# Altium schematic sheet dtb-222.SchDoc
size 381 x 241 mm; SheetNumber: 1; SheetTotal: 1
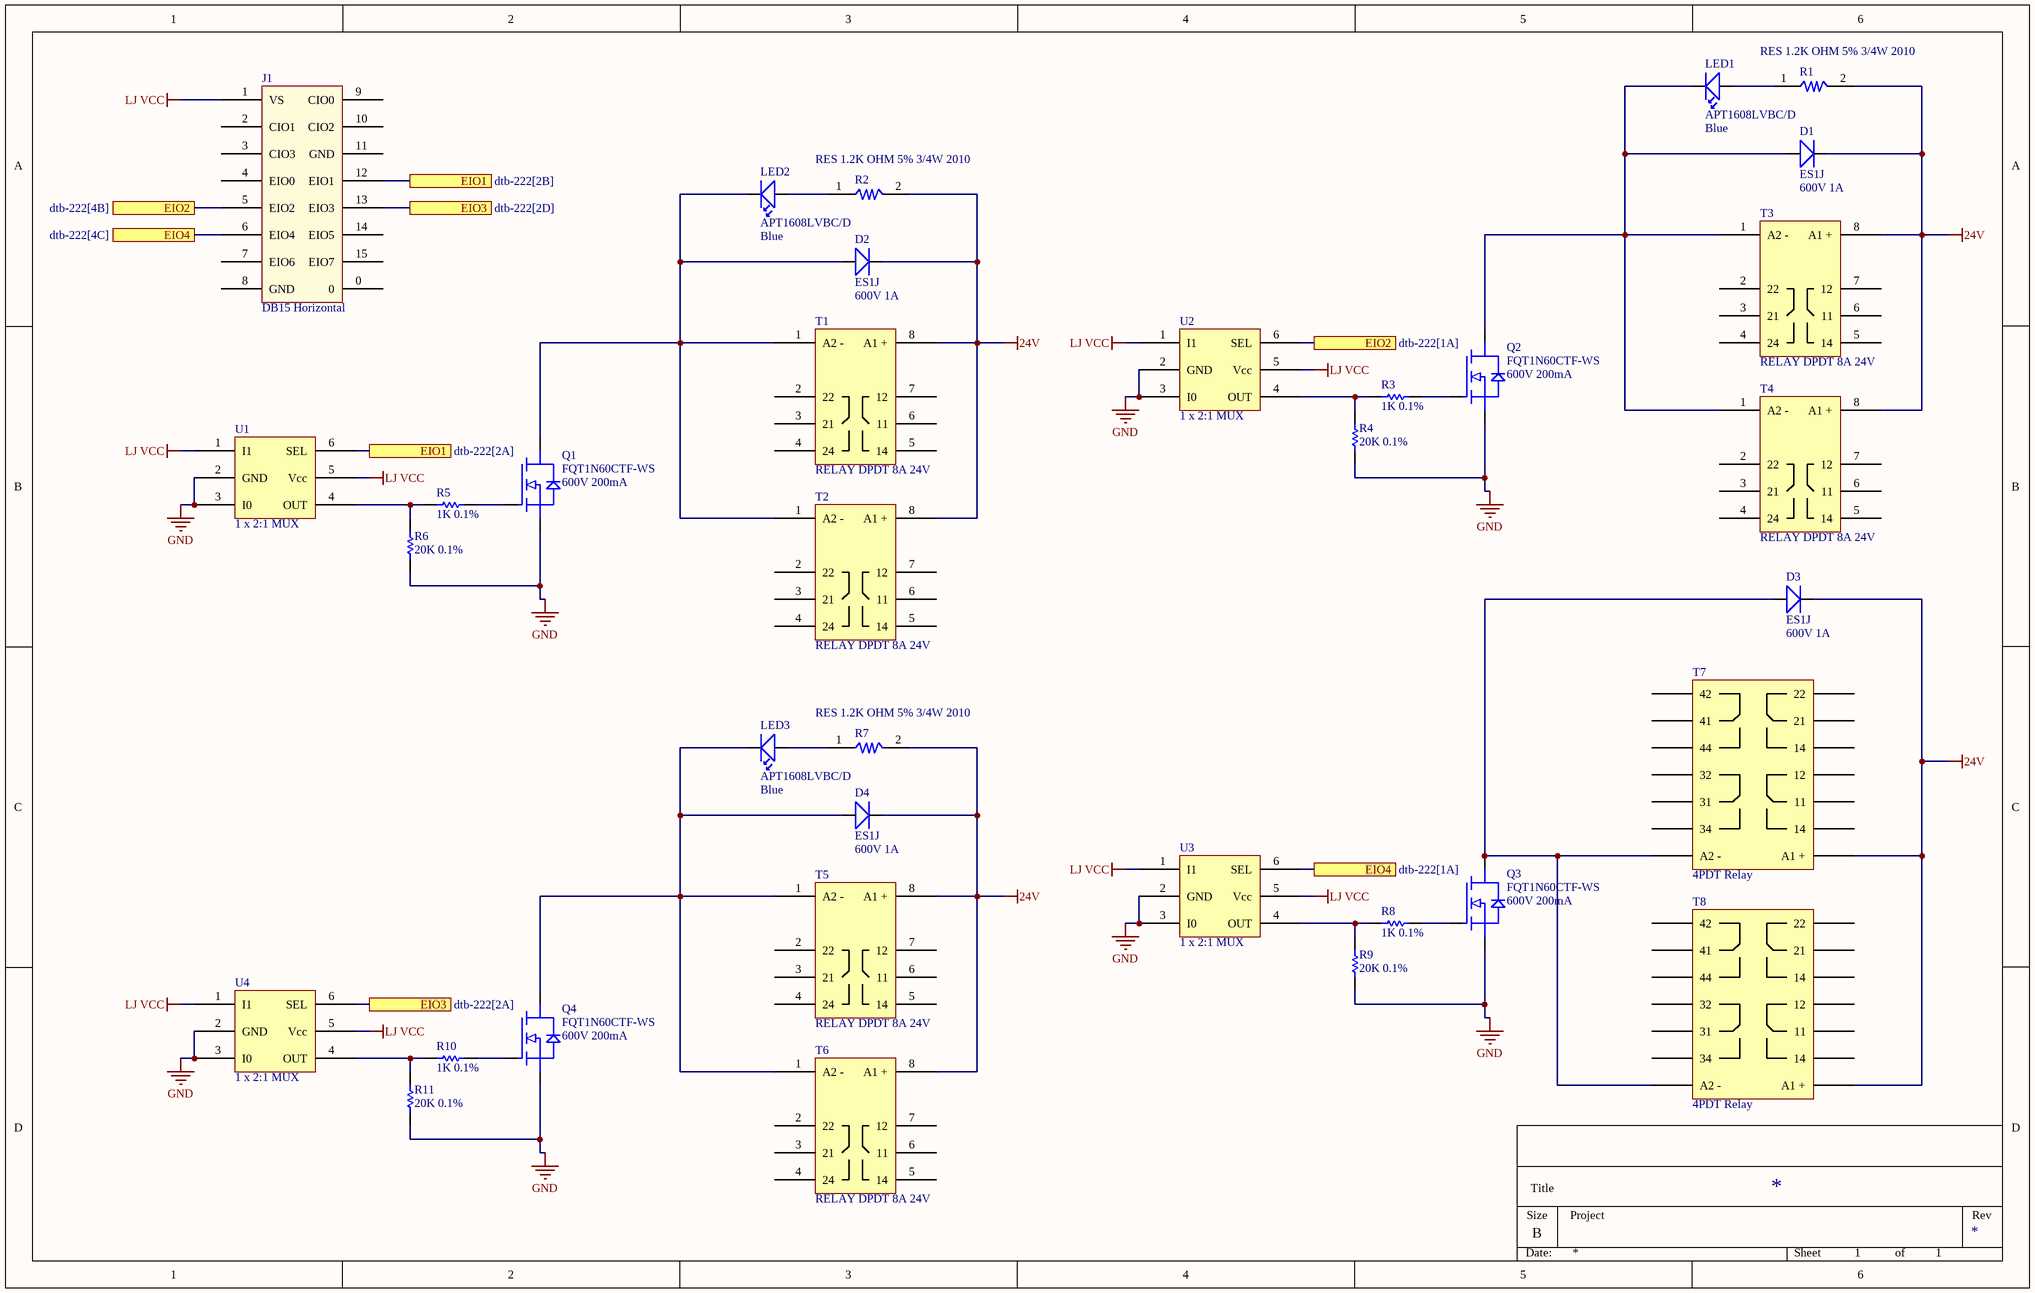
[diagram p0: dtb-222.SchDoc]

## Parts
?  (no value)  (graphical)
D1  ES1J  value 600V 1A  [ES1J]
D2  ES1J  value 600V 1A  [ES1J]
D3  ES1J  value 600V 1A  [ES1J]
D4  ES1J  value 600V 1A  [ES1J]
J1  DB15 Horizontal  [182-015-113R531]
LED1  APT1608LVBC/D  value Blue  [Standard VoltServer 0603 Kingbright HELI2 LED Footprint]
LED2  APT1608LVBC/D  value Blue  [Standard VoltServer 0603 Kingbright HELI2 LED Footprint]
LED3  APT1608LVBC/D  value Blue  [Standard VoltServer 0603 Kingbright HELI2 LED Footprint]
Q1  FQT1N60CTF-WS  value 600V 200mA  [FQT1N60CTF_WS]
Q2  FQT1N60CTF-WS  value 600V 200mA  [FQT1N60CTF_WS]
Q3  FQT1N60CTF-WS  value 600V 200mA  [FQT1N60CTF_WS]
Q4  FQT1N60CTF-WS  value 600V 200mA  [FQT1N60CTF_WS]
R1  RES 1.2K OHM 5% 3/4W 2010  [2010 Resistor]
R2  RES 1.2K OHM 5% 3/4W 2010  [2010 Resistor]
R3  value 1K 0.1%  [Standard VoltServer 0603 Resistor Footprint]  (hidden comment: ERA-3AEB102V)
R4  value 20K 0.1%  [Standard VoltServer 0603 Resistor Footprint]  (hidden comment: ERA-3AEB203V)
R5  value 1K 0.1%  [Standard VoltServer 0603 Resistor Footprint]  (hidden comment: ERA-3AEB102V)
R6  value 20K 0.1%  [Standard VoltServer 0603 Resistor Footprint]  (hidden comment: ERA-3AEB203V)
R7  RES 1.2K OHM 5% 3/4W 2010  [2010 Resistor]
R8  value 1K 0.1%  [Standard VoltServer 0603 Resistor Footprint]  (hidden comment: ERA-3AEB102V)
R9  value 20K 0.1%  [Standard VoltServer 0603 Resistor Footprint]  (hidden comment: ERA-3AEB203V)
R10  value 1K 0.1%  [Standard VoltServer 0603 Resistor Footprint]  (hidden comment: ERA-3AEB102V)
R11  value 20K 0.1%  [Standard VoltServer 0603 Resistor Footprint]  (hidden comment: ERA-3AEB203V)
T1  RELAY DPDT 8A 24V  [2961435]
T2  RELAY DPDT 8A 24V  [2961435]
T3  RELAY DPDT 8A 24V  [2961435]
T4  RELAY DPDT 8A 24V  [2961435]
T5  RELAY DPDT 8A 24V  [2961435]
T6  RELAY DPDT 8A 24V  [2961435]
T7  4PDT Relay  [2903677]
T8  4PDT Relay  [2903677]
U1  1 x 2:1 MUX  [74LVC1G157GV,125]
U2  1 x 2:1 MUX  [74LVC1G157GV,125]
U3  1 x 2:1 MUX  [74LVC1G157GV,125]
U4  1 x 2:1 MUX  [74LVC1G157GV,125]

## Ports
EIO1 (see dtb-222[2A]), EIO1 (see dtb-222[2B]), EIO2 (see dtb-222[1A]), EIO2 (see dtb-222[4B]), EIO3 (see dtb-222[2A]), EIO3 (see dtb-222[2D]), EIO4 (see dtb-222[1A]), EIO4 (see dtb-222[4C])

## Nets
24V: D1.1 D2.1 D3.1 D4.1 R1.2 R2.2 R7.2 T1.8(A1_+) T2.8(A1_+) T3.8(A1_+) T4.8(A1_+) T5.8(A1_+) T6.8(A1_+) T7.1(A1_+) T8.1(A1_+)
GND: Q1.3(S) Q2.3(S) Q3.3(S) Q4.3(S) R4.1 R6.1 R9.1 R11.1 U1.2(GND) U1.3(I0) U2.2(GND) U2.3(I0) U3.2(GND) U3.3(I0) U4.2(GND) U4.3(I0)
LJ VCC: J1.1(VS) U1.1(I1) U1.5(Vcc) U2.1(I1) U2.5(Vcc) U3.1(I1) U3.5(Vcc) U4.1(I1) U4.5(Vcc)
EIO1: J1.12(EIO1) U1.6(SEL) ; port EIO1
EIO2: J1.5(EIO2) U2.6(SEL) ; port EIO2
EIO3: J1.13(EIO3) U4.6(SEL) ; port EIO3
EIO4: J1.6(EIO4) U3.6(SEL) ; port EIO4
NetD1_2: D1.2 LED1.2 Q2.4(D) T3.1(A2_-) T4.1(A2_-)
NetD2_2: D2.2 LED2.2 Q1.4(D) T1.1(A2_-) T2.1(A2_-)
NetD3_2: D3.2 Q3.4(D) T7.2(A2_-) T8.2(A2_-)
NetD4_2: D4.2 LED3.2 Q4.4(D) T5.1(A2_-) T6.1(A2_-)
NetLED1_1: LED1.1 R1.1
NetLED2_1: LED2.1 R2.1
NetLED3_1: LED3.1 R7.1
NetQ1_1: Q1.1(G) R5.1
NetQ2_1: Q2.1(G) R3.1
NetQ3_1: Q3.1(G) R8.1
NetQ4_1: Q4.1(G) R10.1
NetR3_2: R3.2 R4.2 U2.4(OUT)
NetR5_2: R5.2 R6.2 U1.4(OUT)
NetR8_2: R8.2 R9.2 U3.4(OUT)
NetR10_2: R10.2 R11.2 U4.4(OUT)

Not connected (* = marked no-connect by the designer): J1 0 2(CIO1) 3(CIO3) 4(EIO0) 7(EIO6) 8(GND) 9(CIO0) 10(CIO2) 11(GND) 14(EIO5) 15(EIO7); T1 2(22) 3(21) 4(24) 5(14) 6(11) 7(12); T2 2(22) 3(21) 4(24) 5(14) 6(11) 7(12); T3 2(22) 3(21) 4(24) 5(14) 6(11) 7(12); T4 2(22) 3(21) 4(24) 5(14) 6(11) 7(12); T5 2(22) 3(21) 4(24) 5(14) 6(11) 7(12); T6 2(22) 3(21) 4(24) 5(14) 6(11) 7(12); T7 3(11) 4(21) 5(31) 6(41) 7(14) 8(14) 9(34) 10(44) 11(12) 12(22) 13(32) 14(42); T8 3(11) 4(21) 5(31) 6(41) 7(14) 8(14) 9(34) 10(44) 11(12) 12(22) 13(32) 14(42)

## Notes on the sheet
- Size
- Title
- B
- Project
- Rev
- Date:
- Sheet
- of

## Library data of the parts
? = VoltServer Title Block
D1-D4 = ES1J: DIODE 1A 600V 35nS SMA; Manufacturer: Fairchild; Vendor PN: ES1JFSCT-ND; Vendor: Digikey; Manufacturer PN: ES1J
J1 = DB15 LabJack Pinout: 15 Position D-Sub Plug, Male Pins Connector; Manufacturer: NorComp Inc.; Vendor: Digikey; Vendor PN: 182-15ME-ND; Value: DB 16 Male; Manufacturer PN: 182-015-113R531
LED1-LED3 = APT1608LVBC/D: Blue 470nm LED Indication - Discrete 2.65V 0603 (1608 Metric); Manufacturer: Kingbright; Vendor: Digikey; Vendor PN: 754-1933-1-ND; Manufacturer PN: APT1608LVBC/D
Q1-Q4 = FQT1N60CTF-WS: MOSFET N-CH 600V 200MA SOT-223-4; Manufacturer: Fairchild Semiconductor; Vendor: Digikey; Vendor PN: FQT1N60CTF-WSCT-ND; Manufacturer PN: FQT1N60CTF-WS
R1 R2 R7 = RMCF2010JT1K20: 1.2 kOhms ±5% 0.75W, 3/4W Chip Resistor 2010 (5025 Metric) Automotive AEC-Q200 Thick Film; Manufacturer: Stackpole Electionics Inc; Value: 1.2 kOhm, +/- 5%, 0.75W; Vendor: Digi-Key; Vendor PN: RMCF2010JT1K20CT-ND; Manufacturer PN: RMCF2010JT1K20
R3 R5 R8 R10 = ERA-3AEB102V: RES SMD 1K OHM 0.1% 1/10W 0603; Manufacturer: Panasonic; Vendor: Digikey; Vendor PN: P1.0KDBCT-ND; Manufacturer PN: ERA-3AEB102V
R4 R6 R9 R11 = ERA-3AEB203V: RES SMD 20K OHM 0.1% 1/10W 0603; Manufacturer: Panasonic; Vendor: Digikey; Vendor PN: P20KDBCT-ND; Manufacturer PN: ERA-3AEB203V
T1-T6 = 2961435 with R95-132: Relay 2961435 with R95-132 socket for pcb mounting; Manufacturer: Phoenix Contact; NTE Electronics Inc; Manufacturer PN: 2961435; R95-132; Vendor: Digi-Key; Vendor PN: 277-5185-ND; 2368-R95-132-ND; Value: DPDT Relay
T7 T8 = 2903677 with PY14-02: General Purpose Relay 4PDT (4 Form C) 24VDC Coil Socketable with Socket; Manufacturer: Phoenix Contact; Omron Automation and Safety; Manufacturer PN: 2903677; PY14-02; Vendor: Digi-Key; Vendor PN: 277-11902-ND; Z813-ND; Value: 4PDT Relay with Socket
U1-U4 = 74LVC1G157GV,125: Multiplexer 1 x 2:1 6-TSOP; Manufacturer: Nexperia USA Inc.; Vendor: Digi-Key; Vendor PN: 1727-3490-1-ND; Value: 1 x 2:1 MUX; Manufacturer PN: 74LVC1G157GV,125